# Altium schematic sheet Sheet1.SchDoc
size A4; SheetNumber: 1; SheetTotal: 3
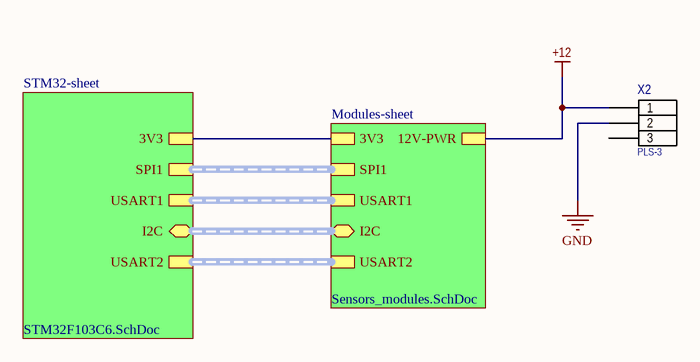
[diagram p0: Sheet1.SchDoc]

## Parts
X2  PLS-3  [PLS-3-3D]

## Sub-sheets
Modules-sheet = Sensors_modules.SchDoc: SPI1 (harness SPI1), USART1 (harness USART1), I2C (bidir, harness I2C), USART2 (harness USART2), 3V3, 12V-PWR
STM32-sheet = STM32F103C6.SchDoc: SPI1 (harness SPI1), USART1 (harness USART1), I2C (bidir, harness I2C), USART2 (harness USART2), 3V3

## Nets
+12: X2.1 ; sheet Modules-sheet/12V-PWR
GND: X2.2
(unnamed): sheet Modules-sheet/3V3, sheet STM32-sheet/3V3

Not connected (* = marked no-connect by the designer): X2 3

## Buses and harness runs
harness sheet Modules-sheet/I2C = sheet STM32-sheet/I2C
harness sheet Modules-sheet/SPI1 = sheet STM32-sheet/SPI1
harness sheet Modules-sheet/USART1 = sheet STM32-sheet/USART1
harness sheet Modules-sheet/USART2 = sheet STM32-sheet/USART2

## Library data of the parts
X2 = PLS-3: Header, 3-Pin; LatestRevisionDate: 17-Jul-2002; LatestRevisionNote: Re-released for DXP Platform.; Publisher: Altium Limited